# EAGLE schematic blink-a-led (EAGLE 7.0.0)
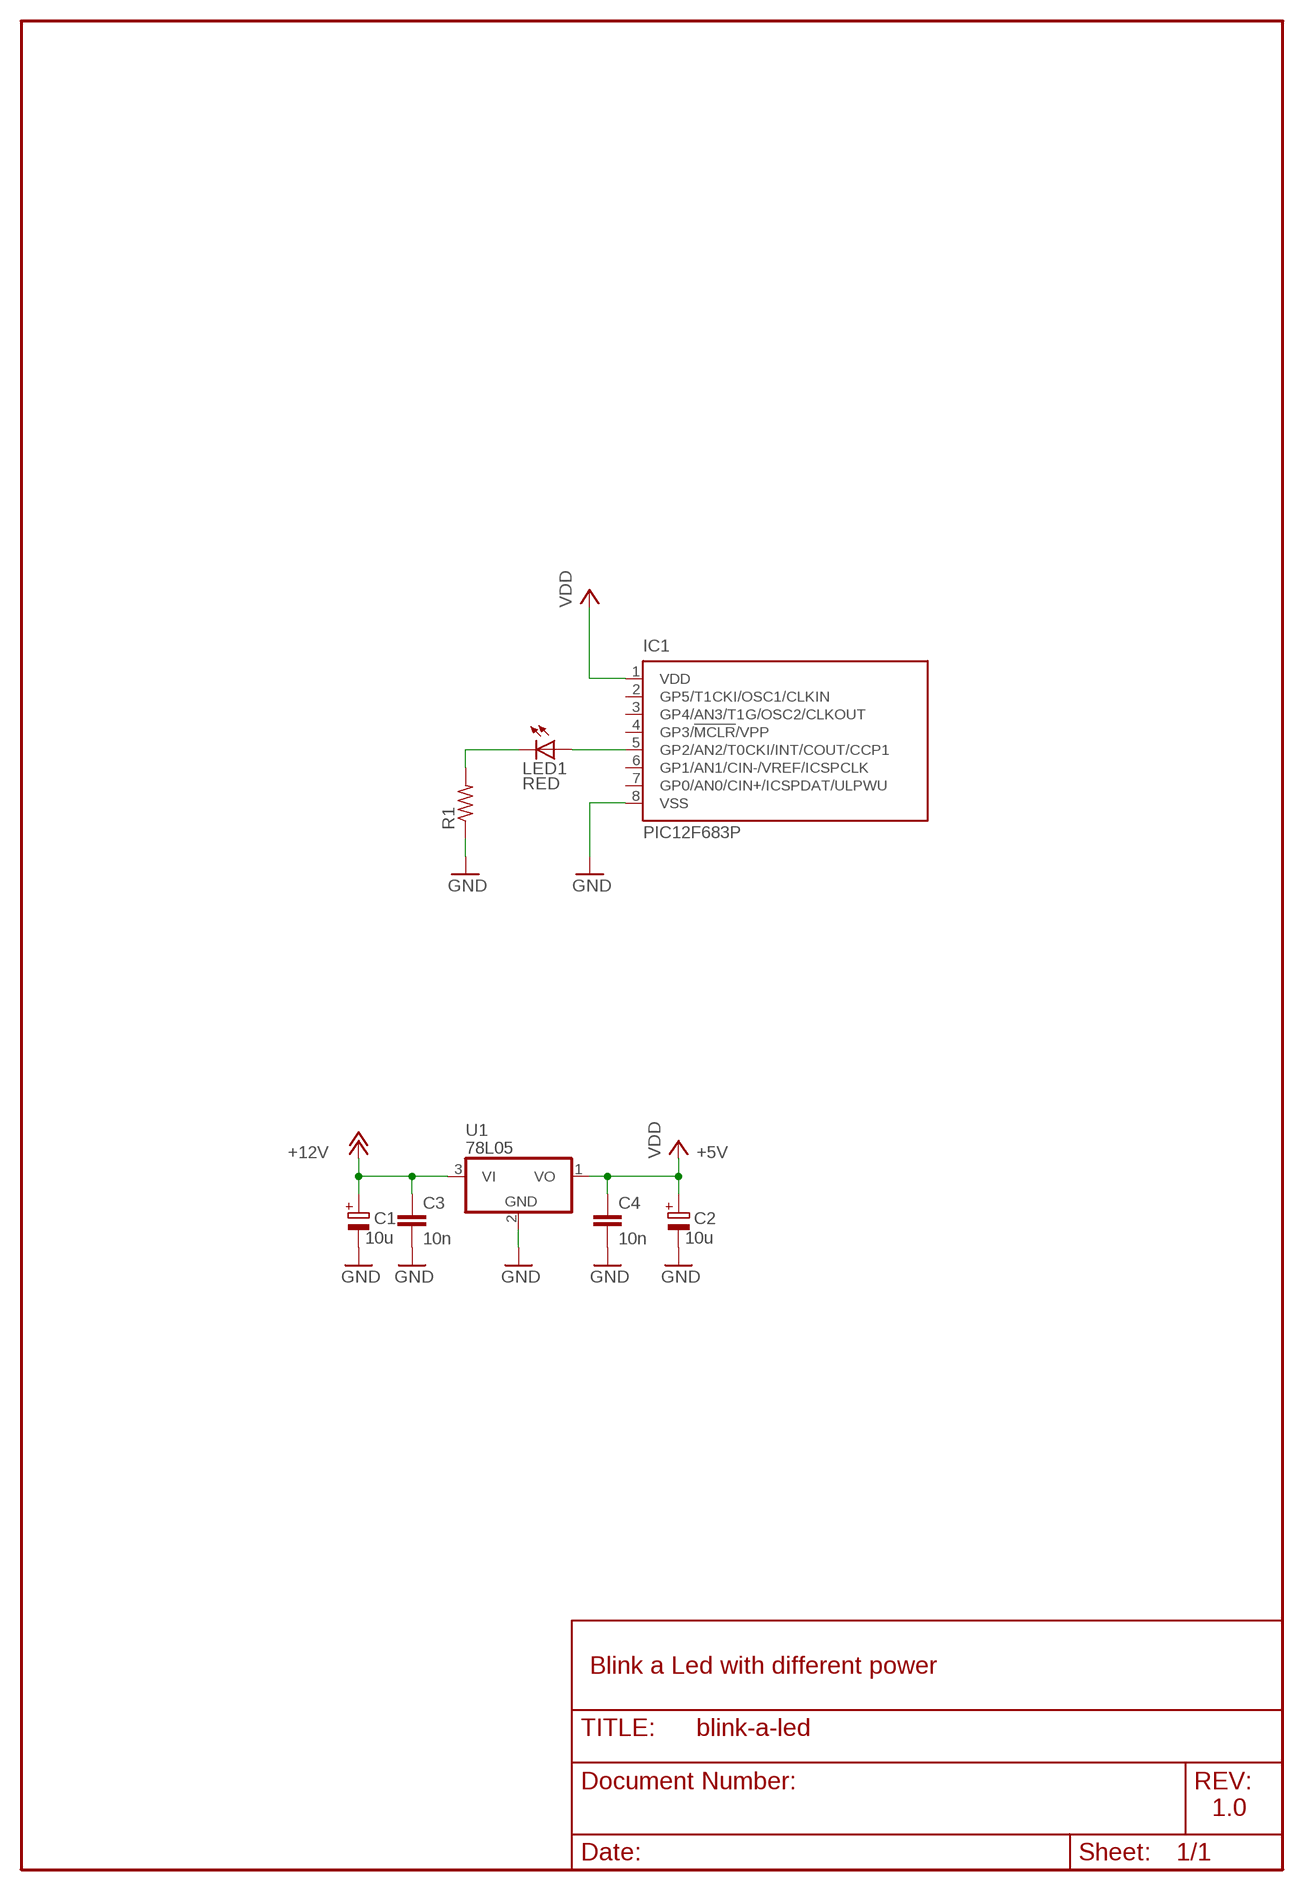
[diagram p0: schematic, sheet 1]

## Parts
C1  10u  E2,5-6  [E2,5-6]
C2  10u  E2,5-6  [E2,5-6]
C3  10n  C-EU025-025X050  [C025-025X050]
C4  10n  C-EU025-025X050  [C025-025X050]
IC1  PIC12F683P  [DIL8]
LED1  RED  LED5MM  [LED5MM]
R1  R-US_0204/7  [0204/7]
U1  78L05  78LXXZ  [TO92]

## Nets
+5V: C2.+ C4.2 IC1.1(VDD) U1.1(VO) ; supply symbol labelled VDD
+12V: C1.+ C3.2 U1.3(VI)
GND: C1.- C2.- C3.1 C4.1 IC1.8(VSS) R1.1 U1.2(GND)
N$1: LED1.K(C) R1.2
N$2: IC1.5(GP2/AN2/T0CKI/INT/COUT/CCP1) LED1.A
Unconnected: IC1.2(GP5/T1CKI/OSC1/CLKIN) IC1.3(GP4/AN3/T1G/OSC2/CLKOUT) IC1.4(GP3/!MCLR!/VPP) IC1.6(GP1/AN1/CIN-/VREF/ICSPCLK) IC1.7(GP0/AN0/CIN+/ICSPDAT/ULPWU)

## Notes on the sheet
- Blink a Led with different power
- 1.0

## Library data of the parts
C1 C2 = polcap:E2,5-6
C3 C4 = rcl:C-EU: Capacitor EUrop Symbol
IC1 = microchip:PIC12F683: 8-Pin Flash-Based, 8-Bit CMOS Microcontrollers with nanoWatt Technology Source: http://ww1.microchip.com/downloads/en/DeviceDoc/41211D_.pdf; MF: MICROCHIP; MPN: PIC12F683-I/P; OC_FARNELL: 9759034; OC_NEWARK: 89H0442
LED1 = led:LED: LED OSRAM: - CHIPLED LG R971, LG N971, LY N971, LG Q971, LY Q971, LO R971, LY R971 LH N974, LH R974 LS Q976, LO Q976, LY Q976 LO Q996 - Hyper CHIPLED LW Q18S LB Q993, LB Q99A, LB R99A - SideLED LS A670, LO A670, LY A670, LG A670, LP A670 LB A673, LV A673, LT A673, LW A673 LH A674 LY A675 LS A676, LA A676, LO A676, LY A676, LW A676 LS A679, LY A679, LG A679 - Hyper Micro SIDELED® LS Y876, LA Y876, LO Y876, LY Y876 LT Y87S - SmartLED LW L88C, LW L88S LB L89C, LB L89S, LG L890 LS L89K, LO L89K, LY L89K LS L896, LA L896, LO L896, LY L896 - TOPLED LS T670, LO T670, LY T670, LG T670, LP T670 LSG T670, LSP T670, LSY T670, LOP T670, LYG T670 LG T671, LOG T671, LSG T671 LB T673, LV T673, LT T673, LW T673 LH T674 LS T676, LA T676, LO T676, LY T676, LB T676, LH T676, LSB T676, LW T676 LB T67C, LV T67C, LT T67C, LS T67K, LO T67K, LY T67K, LW E67C LS E67B, LA E67B, LO E67B, LY E67B, LB E67C, LV E67C, LT E67C LW T67C LS T679, LY T679, LG T679 LS T770, LO T770, LY T770, LG T770, LP T770 LB T773, LV T773, LT T773, LW T773 LH T774 LS E675, LA E675, LY E675, LS T675 LS T776, LA T776, LO T776, LY T776, LB T776 LHGB T686 LT T68C, LB T68C - Hyper Mini TOPLED® LB M676 - Mini TOPLED Santana® LG M470 LS M47K, LO M47K, LY M47K Source: http://www.osram.convergy.de LUXEON: - LUMILED® LXK2-PW12-R00, LXK2-PW12-S00, LXK2-PW14-U00, LXK2-PW14-V00 LXK2-PM12-R00, LXK2-PM12-S00, LXK2-PM14-U00 LXK2-PE12-Q00, LXK2-PE12-R00, LXK2-PE12-S00, LXK2-PE14-T00, LXK2-PE14-U00 LXK2-PB12-K00, LXK2-PB12-L00, LXK2-PB12-M00, LXK2-PB14-N00, LXK2-PB14-P00, LXK2-PB14-Q00 LXK2-PR12-L00, LXK2-PR12-M00, LXK2-PR14-Q00, LXK2-PR14-R00 LXK2-PD12-Q00, LXK2-PD12-R00, LXK2-PD12-S00 LXK2-PH12-R00, LXK2-PH12-S00 LXK2-PL12-P00, LXK2-PL12-Q00, LXK2-PL12-R00 Source: www.luxeon.com KINGBRIGHT: KA-3528ASYC Source: www.kingbright.com
R1 = resistor:R-US_: RESISTOR, American symbol
U1 = linear:78LXXZ: V-Reg. positiv voltage regulator / low power TO92